# EAGLE design Powersplit (EAGLE 9.7.0)
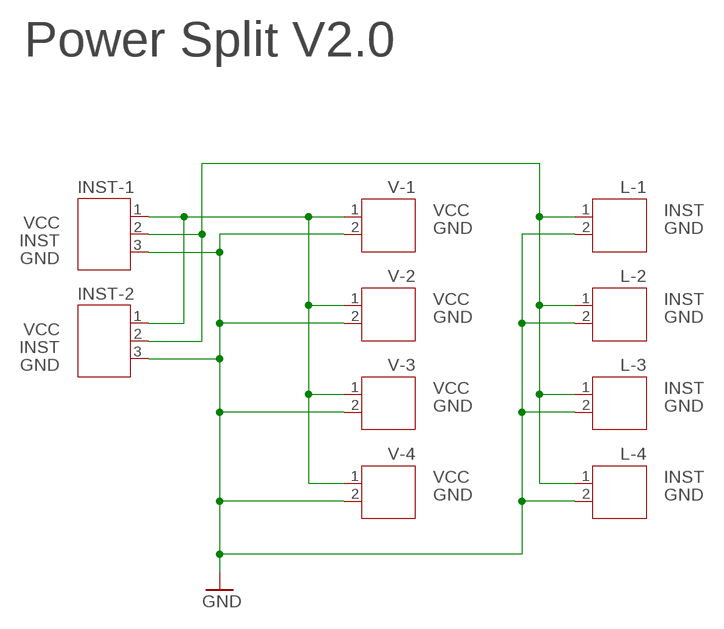
[diagram p0: schematic, sheet 1]

## Parts
INST-1  JST-PH3  [JST-PH3]
INST-2  JST-PH3  [JST-PH3]
L-1  JST-PH2  [JST-PH2]
L-2  JST-PH2  [JST-PH2]
L-3  JST-PH2  [JST-PH2]
L-4  JST-PH2  [JST-PH2]
V-1  JST-PH2  [JST-PH2]
V-2  JST-PH2  [JST-PH2]
V-3  JST-PH2  [JST-PH2]
V-4  JST-PH2  [JST-PH2]

## Nets
GND: INST-1.3 INST-2.3 L-1.2 L-2.2 L-3.2 L-4.2 V-1.2 V-2.2 V-3.2 V-4.2
INST: INST-1.2 INST-2.2 L-1.1 L-2.1 L-3.1 L-4.1
VCC: INST-1.1 INST-2.1 V-1.1 V-2.1 V-3.1 V-4.1

## Notes on the sheet
- Power Split V2.0

## Library data of the parts
INST-1 INST-2 = jst-ph:JST-PH3
L-1-L-4 V-1-V-4 = jst-ph:JST-PH2

## Board
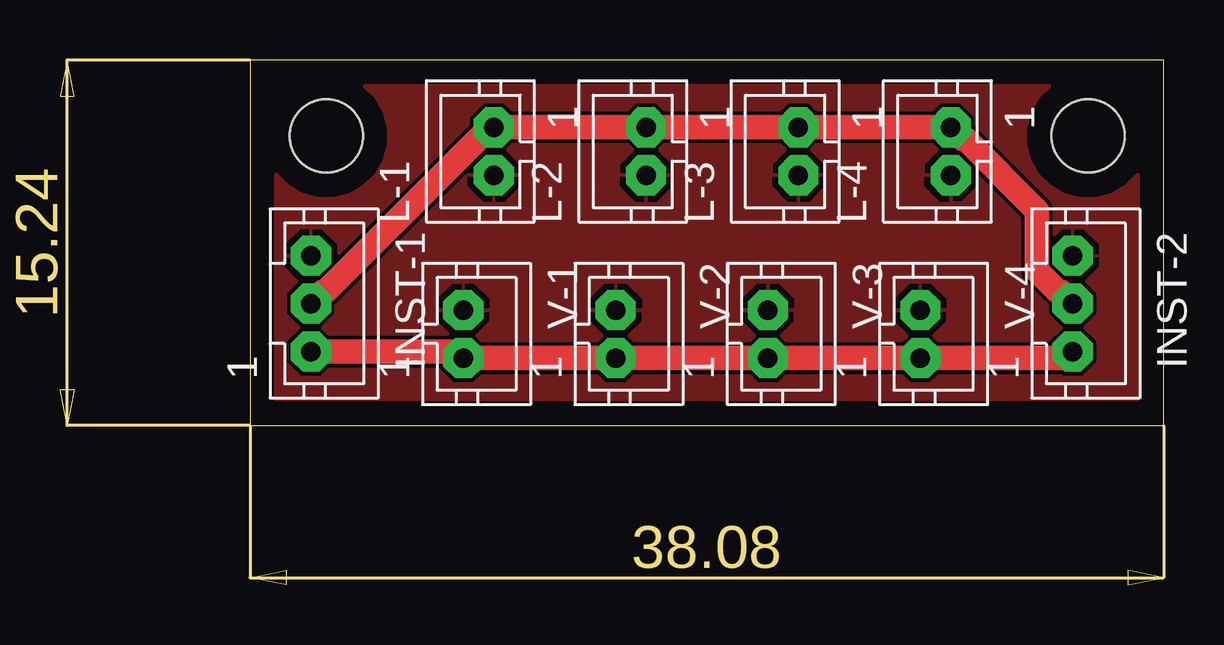
[diagram p1: board, top side]
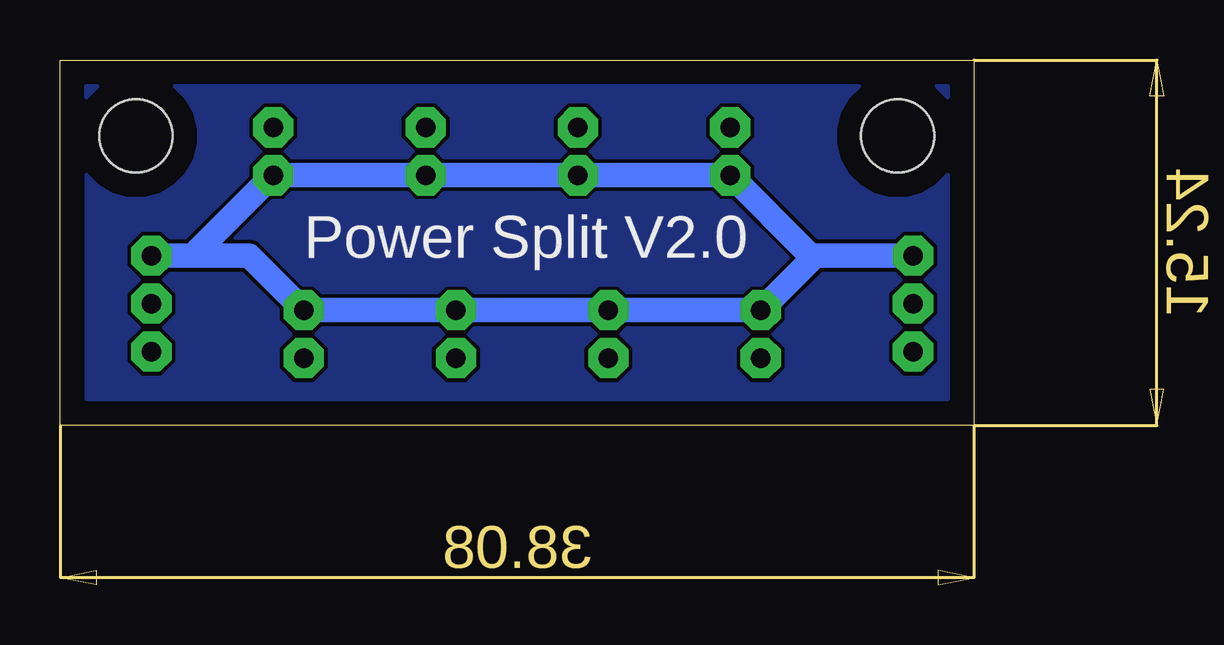
[diagram p2: board, bottom side, seen from below]

Size 38.1 x 15.24 mm. Coordinates in mm from the lower left corner, seen from the top.
Outline: 0,0 38.08,0 38.1,15.24 0,15.24 0,0
Copper layers (1*16): Top / Bottom
Stack-up Default Layer Stack: Top User Defined 0.035mm / Dielectric-1 User Defined 1.5mm / Bottom User Defined 0.035mm
Design rules "default": minimum track width 6mil, minimum drill 0.35mm, track to track 6mil, track to pad 6mil, pad to pad 6mil, via to via 6mil, smd to smd 6mil, copper to edge 40mil, drill to drill 6mil, minimum pad ring 10mil, minimum via ring 8mil, stop-mask expansion 4mil, vias tented up to drill 0mil, thermal gap 10mil
Holes 3.05 mm at 3.17,12.06 34.92,12.06

### Footprints (pad centres in the part's own frame; a part is rotated, then mirrored left to right if it is on the bottom)
JST-PH3 = drill 0.813 pad 1.676 octagon: 1 2,0; 2 0,0; 3 -2,0
JST-PH2 = drill 0.813 pad 1.676 octagon: 1 1,0; 2 -1,0

### Placement (x,y rotation side)
INST-1  2.54,5.08 270 top
INST-2  34.29,5.08 270 top
L-1  10.16,11.43 90 top
L-2  16.51,11.43 90 top
L-3  22.86,11.43 90 top
L-4  29.21,11.43 90 top
V-1  8.89,3.81 270 top
V-2  15.24,3.81 270 top
V-3  21.59,3.81 270 top
V-4  27.94,3.81 270 top

### Tracks (layer width: path | path; a pad name or v marks a point on that pad's centre or on a via)
GN
  pour Bottom: 38.18,15.32 -0.08,15.32 -0.08,-0.08 38.18,-0.08
GND
  Bottom 1.016: INST-1.3 6.62,7.08 | 6.62,7.08 V-1.2 V-2.2 V-3.2 V-4.2 30.21,7.08 INST-2.3 32.56,7.08 L-4.2 L-3.2 L-2.2 L-1.2 6.81,7.08 6.62,7.08
  pour Top: 38.18,15.32 -0.08,15.32 -0.08,-0.08 38.18,-0.08
INST
  Top 1.016: INST-1.2 3.04,5.58 3.16,5.58 10.01,12.43 L-1.1 L-2.1 L-3.1 L-4.1 29.71,11.93 29.83,11.93 32.79,8.97 32.79,6.46 33.67,5.58 33.79,5.58 INST-2.2
VCC
  Top 1.016: INST-1.1 8.62,3.08 V-1.1 V-2.1 V-3.1 V-4.1 34.02,2.81 INST-2.1

### Text on the board
bNames: Power Split V2.0